# Altium schematic sheet PiHAT_Power.SchDoc
size A4
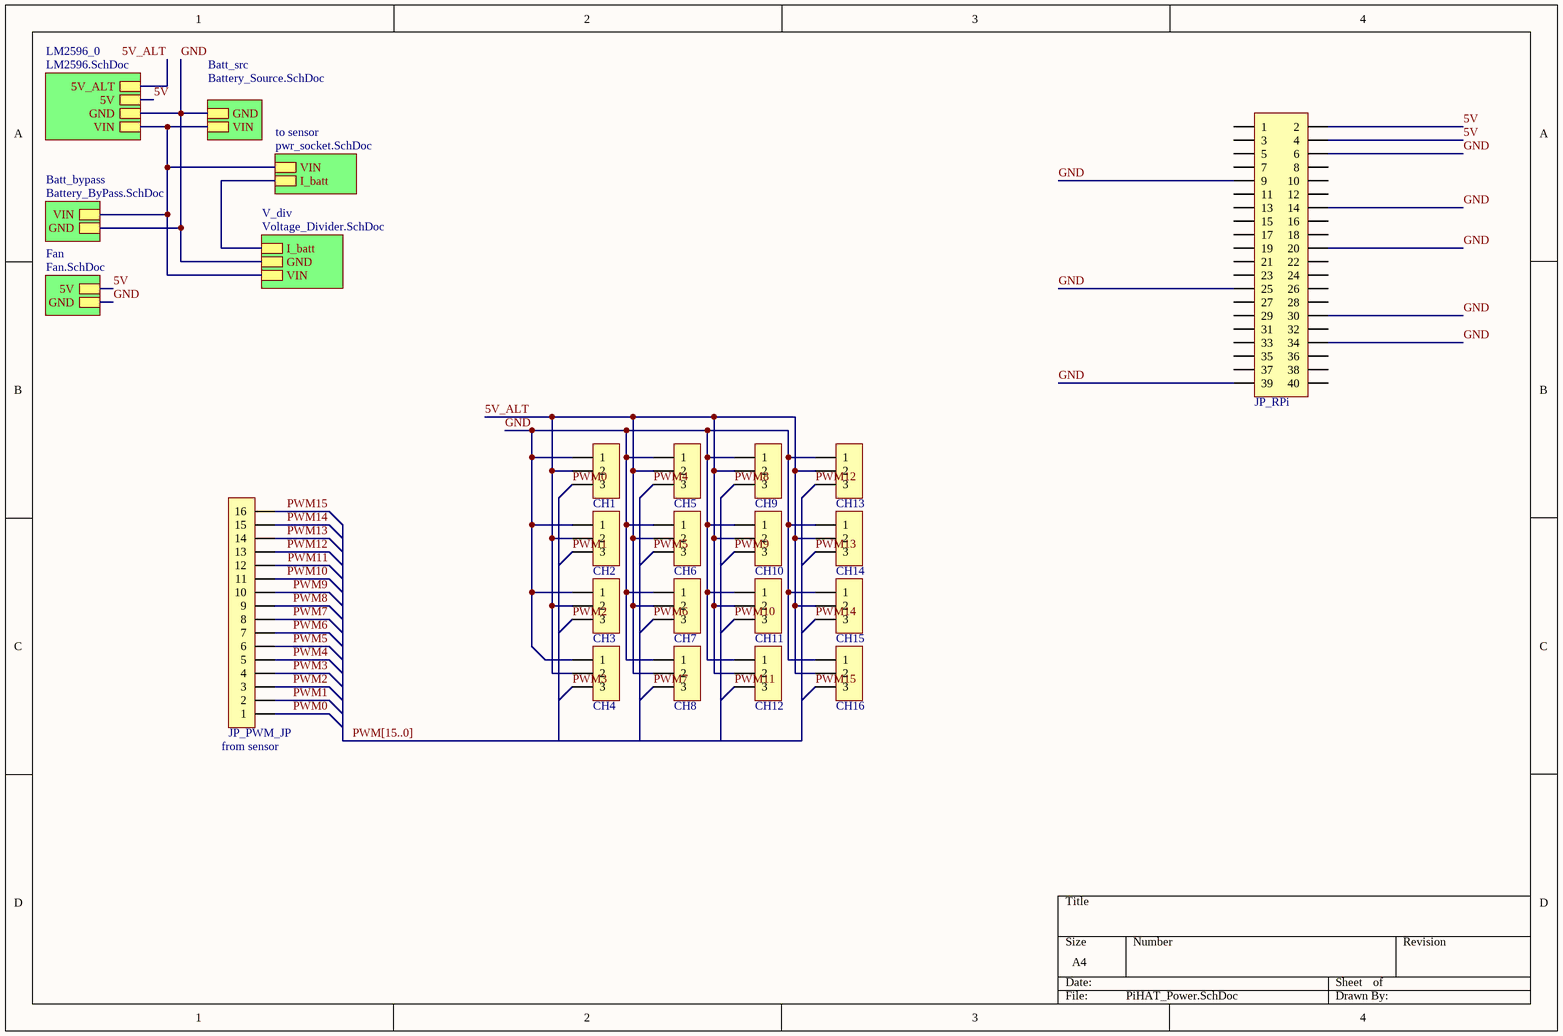
[diagram p0: PiHAT_Power.SchDoc]

## Parts
CH1  HDR-1X3  [HDR2.54-LI-3P]  (value not drawn)
CH2  HDR-1X3  [HDR2.54-LI-3P]  (value not drawn)
CH3  HDR-1X3  [HDR2.54-LI-3P]  (value not drawn)
CH4  HDR-1X3  [HDR2.54-LI-3P]  (value not drawn)
CH5  HDR-1X3  [HDR2.54-LI-3P]  (value not drawn)
CH6  HDR-1X3  [HDR2.54-LI-3P]  (value not drawn)
CH7  HDR-1X3  [HDR2.54-LI-3P]  (value not drawn)
CH8  HDR-1X3  [HDR2.54-LI-3P]  (value not drawn)
CH9  HDR-1X3  [HDR2.54-LI-3P]  (value not drawn)
CH10  HDR-1X3  [HDR2.54-LI-3P]  (value not drawn)
CH11  HDR-1X3  [HDR2.54-LI-3P]  (value not drawn)
CH12  HDR-1X3  [HDR2.54-LI-3P]  (value not drawn)
CH13  HDR-1X3  [HDR2.54-LI-3P]  (value not drawn)
CH14  HDR-1X3  [HDR2.54-LI-3P]  (value not drawn)
CH15  HDR-1X3  [HDR2.54-LI-3P]  (value not drawn)
CH16  HDR-1X3  [HDR2.54-LI-3P]  (value not drawn)
JP_PWM_JP  HDR-1X16  [HDR2.54-M-LI-16P]  (value not drawn)
JP_RPi  Header 2X11  [HDR2.54-LI-2x20P]  (value not drawn)

## Sub-sheets
Batt_bypass = Battery_ByPass.SchDoc: GND, VIN
Batt_src = Battery_Source.SchDoc: GND, VIN
Fan = Fan.SchDoc: 5V, GND
LM2596_0 = LM2596.SchDoc: 5V, GND, VIN, 5V_ALT
to sensor = pwr_socket.SchDoc: I_batt, VIN
V_div = Voltage_Divider.SchDoc: I_batt, GND, VIN

## Nets
5V: JP_RPi.2 JP_RPi.4 ; sheet LM2596_0/5V, sheet Fan/5V
5V_ALT: CH1.2 CH2.2 CH3.2 CH4.2 CH5.2 CH6.2 CH7.2 CH8.2 CH9.2 CH10.2 CH11.2 CH12.2 CH13.2 CH14.2 CH15.2 CH16.2 ; sheet LM2596_0/5V_ALT
GND: CH1.1 CH2.1 CH3.1 CH4.1 CH5.1 CH6.1 CH7.1 CH8.1 CH9.1 CH10.1 CH11.1 CH12.1 CH13.1 CH14.1 CH15.1 CH16.1 JP_RPi.6 JP_RPi.9 JP_RPi.14 JP_RPi.20 JP_RPi.25 JP_RPi.30 JP_RPi.34 JP_RPi.39 ; sheet LM2596_0/GND, sheet Batt_src/GND, sheet Batt_bypass/GND, sheet Fan/GND, sheet V_div/GND
PWM0: CH1.3 JP_PWM_JP.1
PWM1: CH2.3 JP_PWM_JP.2
PWM2: CH3.3 JP_PWM_JP.3
PWM3: CH4.3 JP_PWM_JP.4
PWM4: CH5.3 JP_PWM_JP.5
PWM5: CH6.3 JP_PWM_JP.6
PWM6: CH7.3 JP_PWM_JP.7
PWM7: CH8.3 JP_PWM_JP.8
PWM8: CH9.3 JP_PWM_JP.9
PWM9: CH10.3 JP_PWM_JP.10
PWM10: CH11.3 JP_PWM_JP.11
PWM11: CH12.3 JP_PWM_JP.12
PWM12: CH13.3 JP_PWM_JP.13
PWM13: CH14.3 JP_PWM_JP.14
PWM14: CH15.3 JP_PWM_JP.15
PWM15: CH16.3 JP_PWM_JP.16
(unnamed): sheet LM2596_0/VIN, sheet Batt_src/VIN, sheet Batt_bypass/VIN, sheet V_div/VIN, sheet to sensor/VIN
(unnamed): sheet V_div/I_batt, sheet to sensor/I_batt

Not connected (* = marked no-connect by the designer): JP_RPi 1 3 5 7 8 10 11 12 13 15 16 17 18 19 21 22 23 24 26 27 28 29 31 32 33 35 36 37 38 40

## Buses and harness runs
bus PWM[15..0]

## Notes on the sheet
- (near JP_PWM_JP) from sensor

## Library data of the parts
CH1-CH16 = Header 3: 3P接插件; 版权归属: 源创客; BOM名称: 3P接插件; 学习资源: www.ooocke.com
JP_PWM_JP = Header 16: 16P接插件; 版权归属: 源创客; BOM名称: 16P接插件; 学习资源: www.ooocke.com
JP_RPi = Header 20X2: 20*2P接插件; 版权归属: 源创客; BOM名称: 20*2P接插件; 学习资源: www.ooocke.com